# Altium schematic sheet USB_Translator.SchDoc
size A4; SheetNumber: 1; SheetTotal: 1
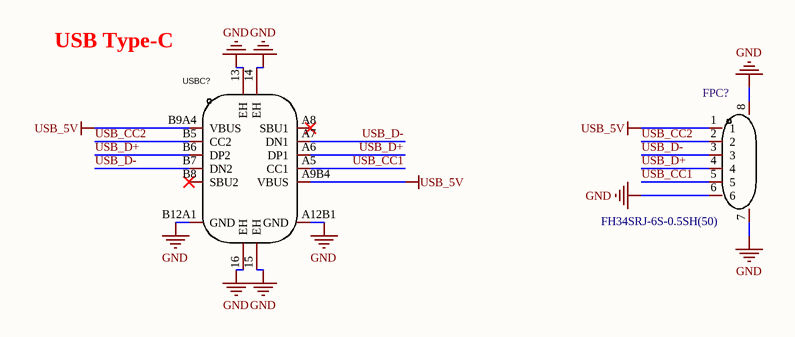
[diagram p0: USB_Translator.SchDoc]

## Parts
FPC?  FH34SRJ-6S-0.5SH(50)  [FFC-SMD_6P-P0.50_FH34SRJ-6S-0.5SH]
USBC?  918-418K2024S40000  [USB-C-SMD_TYPE-C-USB-4]  (value not drawn)

## Nets
GND: FPC?.6 FPC?.7 FPC?.8 USBC?.13(EH) USBC?.14(EH) USBC?.15(EH) USBC?.16(EH) USBC?.A12B1(GND) USBC?.B12A1(GND)
USB_5V: FPC?.1 USBC?.A9B4(VBUS) USBC?.B9A4(VBUS)
USB_CC1: FPC?.5 USBC?.A5(CC1)
USB_CC2: FPC?.2 USBC?.B5(CC2)
USB_D+: FPC?.4 USBC?.A6(DP1) USBC?.B6(DP2)
USB_D-: FPC?.3 USBC?.A7(DN1) USBC?.B7(DN2)

Not connected (* = marked no-connect by the designer): USBC? A8(SBU1)* B8(SBU2)*

## Notes on the sheet
- USB Type-C
- Title
- Size:
- Date:
- A4
- Number:
- Time:
- Revision:
- Sheet
- of
- 后厂村路直博生
- File:

## Library data of the parts
FPC? = FH34SRJ-6S-0.5SH(50): Manufacturer: HRS(广濑); Add into BOM: yes; Number of Contacts: 6P; Pitch: 0.5mm; FFC, FCB Thickness: 0.3mm; Symbol: FH34SRJ-6S-0.5SH(50); Device: FH34SRJ-6S-0.5SH(50); Supplier: LCSC; Supplier Part: C224194; Manufacturer Part: FH34SRJ-6S-0.5SH(50); JLCPCB Part Class: Extended Part; LCSC Part Name: 间距:0.5mm P数:6P 双侧触点/上下接; Supplier Footprint: SMD,P=0.5mm,卧贴; Datasheet: https://atta.szlcsc.com/upload/public/pdf/source/20180712/C224194_08937A353F43080B85824A8384727686.pdf; Convert to PCB: yes; Locking Feature: -; Contact Type: 双侧触点/上下接; Mounting Type: 卧贴; Height Above Board: 1mm; Contact Material: 磷青铜; Contact Plating: 金; Operating Temperature Range: -55℃~+105℃; Soldering Temperature(Max): -
USBC? = 918-418K2024S40000: Manufacturer: 精拓金; Symbol: TYPE-C 3.1 MT 16P_C168688; Add into BOM: yes; Connector Type: Type-C; Gender: 母座; Number of Contacts: 16P; Number of Ports: 1; Name: 918-418K2024S40000; Device: 918-418K2024S40000; LCSC Part Name: Type-C 母座; Supplier Part: C168688; Manufacturer Part: 918-418K2024S40000; Supplier Footprint: SMD; JLCPCB Part Class: Extended Part; Datasheet: https://atta.szlcsc.com/upload/public/pdf/source/20230504/AD68741A173EB676C7BDD03FFA4DE90F.pdf; Supplier: LCSC; Convert to PCB: yes; Standard: -